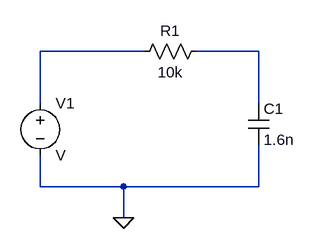
[diagram p0: schematic Priklad1.asc]
Priklad1.asc, the LTspice schematic file:
Version 4
SHEET 1 880 680
WIRE 144 144 -16 144
WIRE 320 144 224 144
WIRE -16 224 -16 144
WIRE 320 224 320 144
WIRE -16 352 -16 304
WIRE 112 352 -16 352
WIRE 320 352 320 288
WIRE 320 352 112 352
WIRE 112 400 112 352
FLAG 112 400 0
SYMBOL voltage -16 208 R0
SYMATTR InstName V1
SYMBOL cap 304 224 R0
SYMATTR InstName C1
SYMATTR Value 1.6n
SYMBOL res 240 128 R90
WINDOW 0 0 56 VBottom 2
WINDOW 3 32 56 VTop 2
SYMATTR InstName R1
SYMATTR Value 10k

The netlist it stands for:
* Priklad1.asc
V1 N001 0 V
C1 N002 0 1.6n
R1 N002 N001 10k
.backanno
.end